# Altium schematic sheet main.SchDoc
size A4
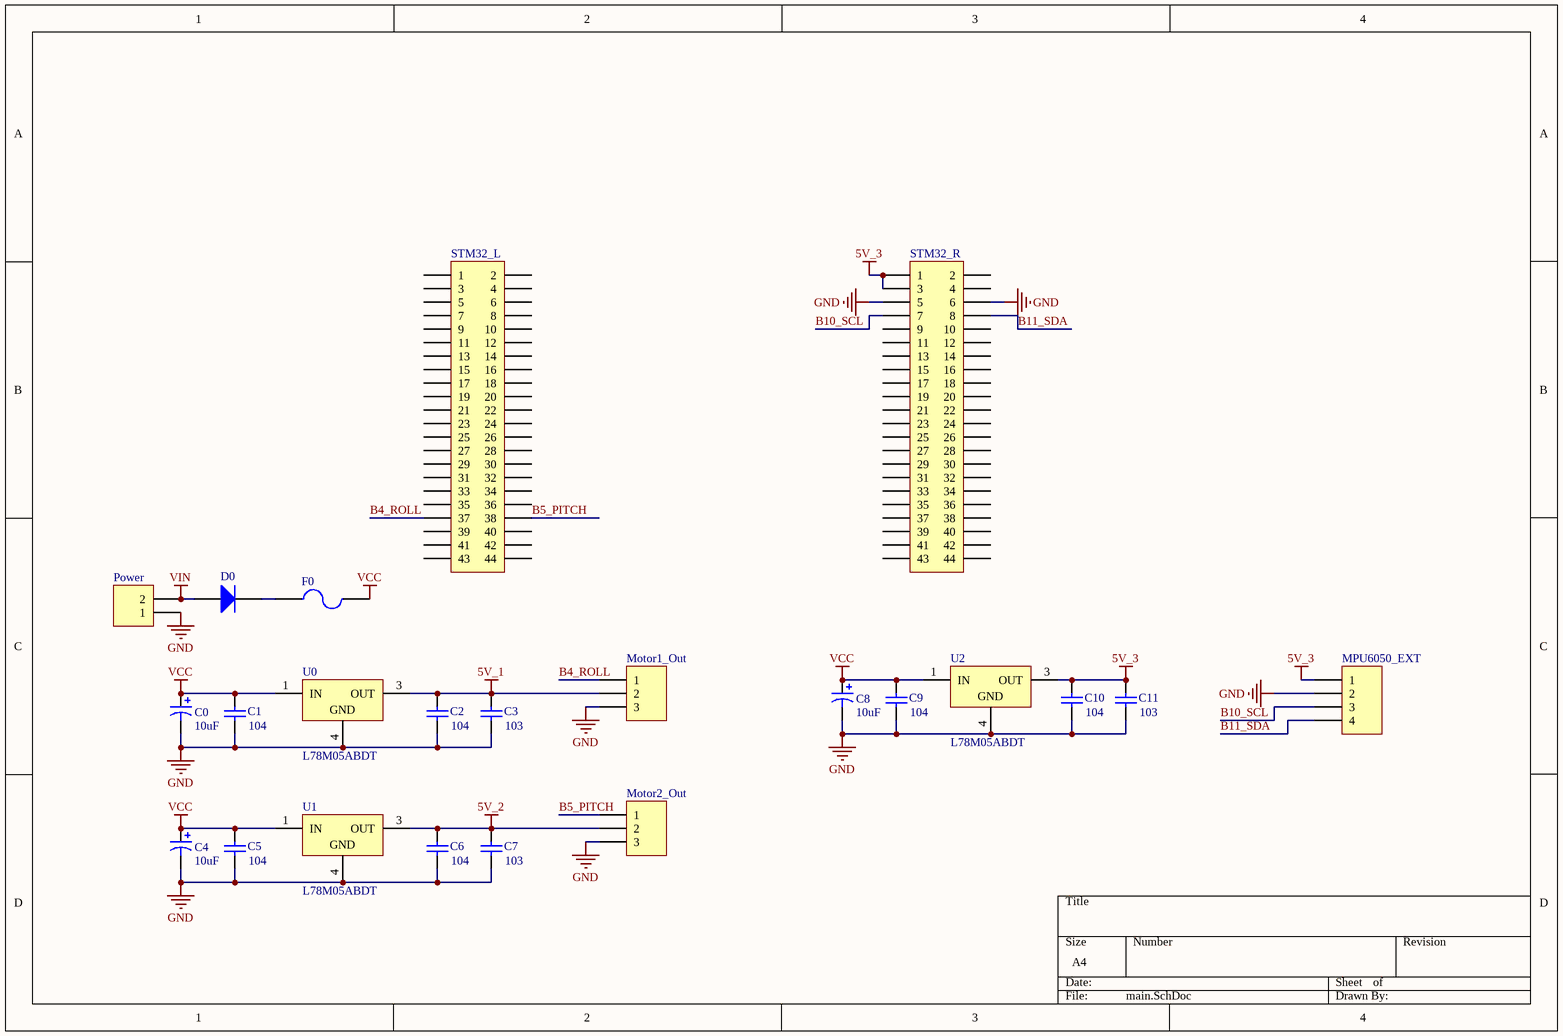
[diagram p0: main.SchDoc]

## Parts
C0  value 10uF  [1206A]  (hidden comment: Cap Pol1)
C1  value 104  [0805]  (hidden comment: Cap Semi)
C2  value 104  [0805]  (hidden comment: Cap Semi)
C3  value 103  [0805]  (hidden comment: Cap Semi)
C4  value 10uF  [1206A]  (hidden comment: Cap Pol1)
C5  value 104  [0805]  (hidden comment: Cap Semi)
C6  value 104  [0805]  (hidden comment: Cap Semi)
C7  value 103  [0805]  (hidden comment: Cap Semi)
C8  value 10uF  [1206A]  (hidden comment: Cap Pol1)
C9  value 104  [0805]  (hidden comment: Cap Semi)
C10  value 104  [0805]  (hidden comment: Cap Semi)
C11  value 103  [0805]  (hidden comment: Cap Semi)
D0  Diode  [DIODE-1206]  (value not drawn)
F0  Fuse 2  [1812]  (value not drawn)
Motor1_Out  Header 3  [HDR1X3]  (value not drawn)
Motor2_Out  Header 3  [HDR1X3]  (value not drawn)
MPU6050_EXT  Header 4  [HDR1X4]  (value not drawn)
Power  Header 2  [HDR1X2]  (value not drawn)
STM32_L  Header 22X2  [HDR2X22]  (value not drawn)
STM32_R  Header 22X2  [HDR2X22]  (value not drawn)
U0  L78M05ABDT  [TO-252]
U1  L78M05ABDT  [TO-252]
U2  L78M05ABDT  [TO-252]

## Nets
5V_1: C2.2 C3.2 Motor1_Out.2 U0.3(OUT)
5V_2: C6.2 C7.2 Motor2_Out.2 U1.3(OUT)
5V_3: C10.2 C11.2 MPU6050_EXT.1 STM32_R.1 STM32_R.3 U2.3(OUT)
GND: C0.2 C1.1 C2.1 C3.1 C4.2 C5.1 C6.1 C7.1 C8.2 C9.1 C10.1 C11.1 Motor1_Out.3 Motor2_Out.3 MPU6050_EXT.2 Power.1 STM32_R.5 STM32_R.6 U0.4(GND) U1.4(GND) U2.4(GND)
VCC: C0.1 C1.2 C4.1 C5.2 C8.1 C9.2 F0.2 U0.1(IN) U1.1(IN) U2.1(IN)
VIN: D0.1(A) Power.2
B4_ROLL: Motor1_Out.1 STM32_L.37
B5_PITCH: Motor2_Out.1 STM32_L.38
B10_SCL: MPU6050_EXT.3 STM32_R.7
B11_SDA: MPU6050_EXT.4 STM32_R.8
NetD0_2: D0.2(K) F0.1

Not connected (* = marked no-connect by the designer): STM32_L 1 2 3 4 5 6 7 8 9 10 11 12 13 14 15 16 17 18 19 20 21 22 23 24 25 26 27 28 29 30 31 32 33 34 35 36 39 40 41 42 43 44; STM32_R 2 4 9 10 11 12 13 14 15 16 17 18 19 20 21 22 23 24 25 26 27 28 29 30 31 32 33 34 35 36 37 38 39 40 41 42 43 44

## Library data of the parts
C0 C4 C8 = Cap Pol1: Polarized Capacitor (Radial); Published: 8-Jun-2000; LatestRevisionDate: 17-Jul-2002; LatestRevisionNote: Re-released for DXP Platform.; PackageReference: RB7.6-15; Publisher: Altium Limited; PackageDescription: Polarized Capacitor (Radial); 2 Leads
C1-C3 C5-C7 C9-C11 = Cap Semi: Capacitor (Semiconductor SIM Model); Published: 8-Jun-2000; LatestRevisionDate: 29-May-2009; LatestRevisionNote: IPC-7351 Footprint Added.; PackageReference: C1206; Publisher: Altium Limited; PackageDescription: Chip Capacitor
D0 = Diode: Default Diode; Published: 8-Jun-2000; LatestRevisionDate: 17-Jul-2002; LatestRevisionNote: Re-released for DXP Platform.; PackageVersion: Sep-1996; PackageReference: SMC; Publisher: Altium Limited; PackageDescription: DO-214-AB/SMC; 2 C-Bend Leads; Body 7.9 x 5.9 mm, inc. leads (LxW); Code_JEDEC: DO-214-AB
F0 = Fuse 2: Fuse; Published: 8-Jun-2000; LatestRevisionDate: 17-Jul-2002; LatestRevisionNote: Re-released for DXP Platform.; PackageReference: PIN-W2/E2.8; Publisher: Altium Limited; PackageDescription: Thru-Hole; 2 Leads
Motor1_Out Motor2_Out = Header 3: Header, 3-Pin; LatestRevisionDate: 17-Jul-2002; LatestRevisionNote: Re-released for DXP Platform.; Publisher: Altium Limited
MPU6050_EXT = Header 4: Header, 4-Pin; LatestRevisionDate: 17-Jul-2002; LatestRevisionNote: Re-released for DXP Platform.; Publisher: Altium Limited
Power = Header 2: Header, 2-Pin; LatestRevisionDate: 17-Jul-2002; LatestRevisionNote: Re-released for DXP Platform.; Publisher: Altium Limited
STM32_L STM32_R = Header 22X2: Header, 22-Pin, Dual row; LatestRevisionDate: 17-Jul-2002; LatestRevisionNote: Re-released for DXP Platform.; Publisher: Altium Limited
U0-U2 = L78M05ABDT: Precision 500mA Regulator; Published: 24-Aug-2001; LatestRevisionDate: 06-Jun-2005; LatestRevisionNote: PCB pads lengthened.; DatasheetVersion: Mar-1997; PackageVersion: Jun-2004; PackageReference: TO-252; Publisher: Altium Limited; PackageDescription: D-PAK/TO-252-AA; 3 Leads (1 Cropped); Body 10.1 (inc. leads) x 6.6 mm (LxW max); ComponentLink1Description: Manufacturer Link; ComponentLink1URL: http://www.st.com/; ComponentLink2Description: Datasheet; ComponentLink2URL: http://www.st.com/stonline/products/literature/ds/2147/l78m05ab.pdf